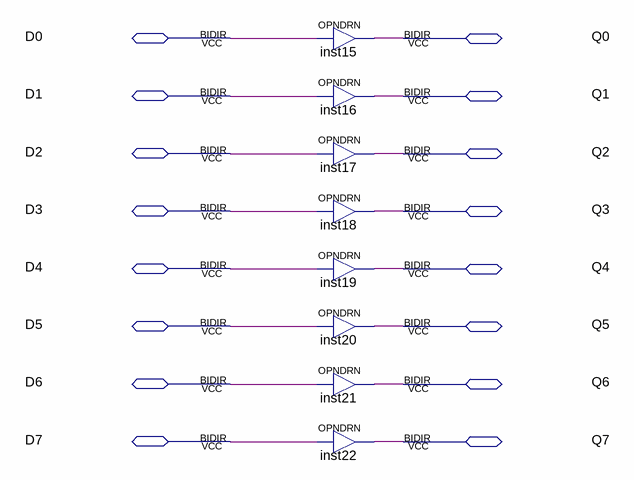
[diagram p0: schematic sheet]
// Quartus schematic 8opendrn.bdf as structural Verilog: 8 symbols, 16 pins
module \8opendrn  (
  inout  D0,
  inout  Q0,
  inout  D1,
  inout  Q1,
  inout  D2,
  inout  Q2,
  inout  D3,
  inout  Q3,
  inout  D4,
  inout  Q4,
  inout  D5,
  inout  Q5,
  inout  D6,
  inout  Q6,
  inout  D7,
  inout  Q7
);

  OPNDRN inst15 (.IN(D0), .OUT(Q0));
  OPNDRN inst16 (.IN(D1), .OUT(Q1));
  OPNDRN inst17 (.IN(D2), .OUT(Q2));
  OPNDRN inst18 (.IN(D3), .OUT(Q3));
  OPNDRN inst19 (.IN(D4), .OUT(Q4));
  OPNDRN inst20 (.IN(D5), .OUT(Q5));
  OPNDRN inst21 (.IN(D6), .OUT(Q6));
  OPNDRN inst22 (.IN(D7), .OUT(Q7));
endmodule
